# EAGLE schematic M8300B (EAGLE 6.6.0)

## Sheet 1 of 3
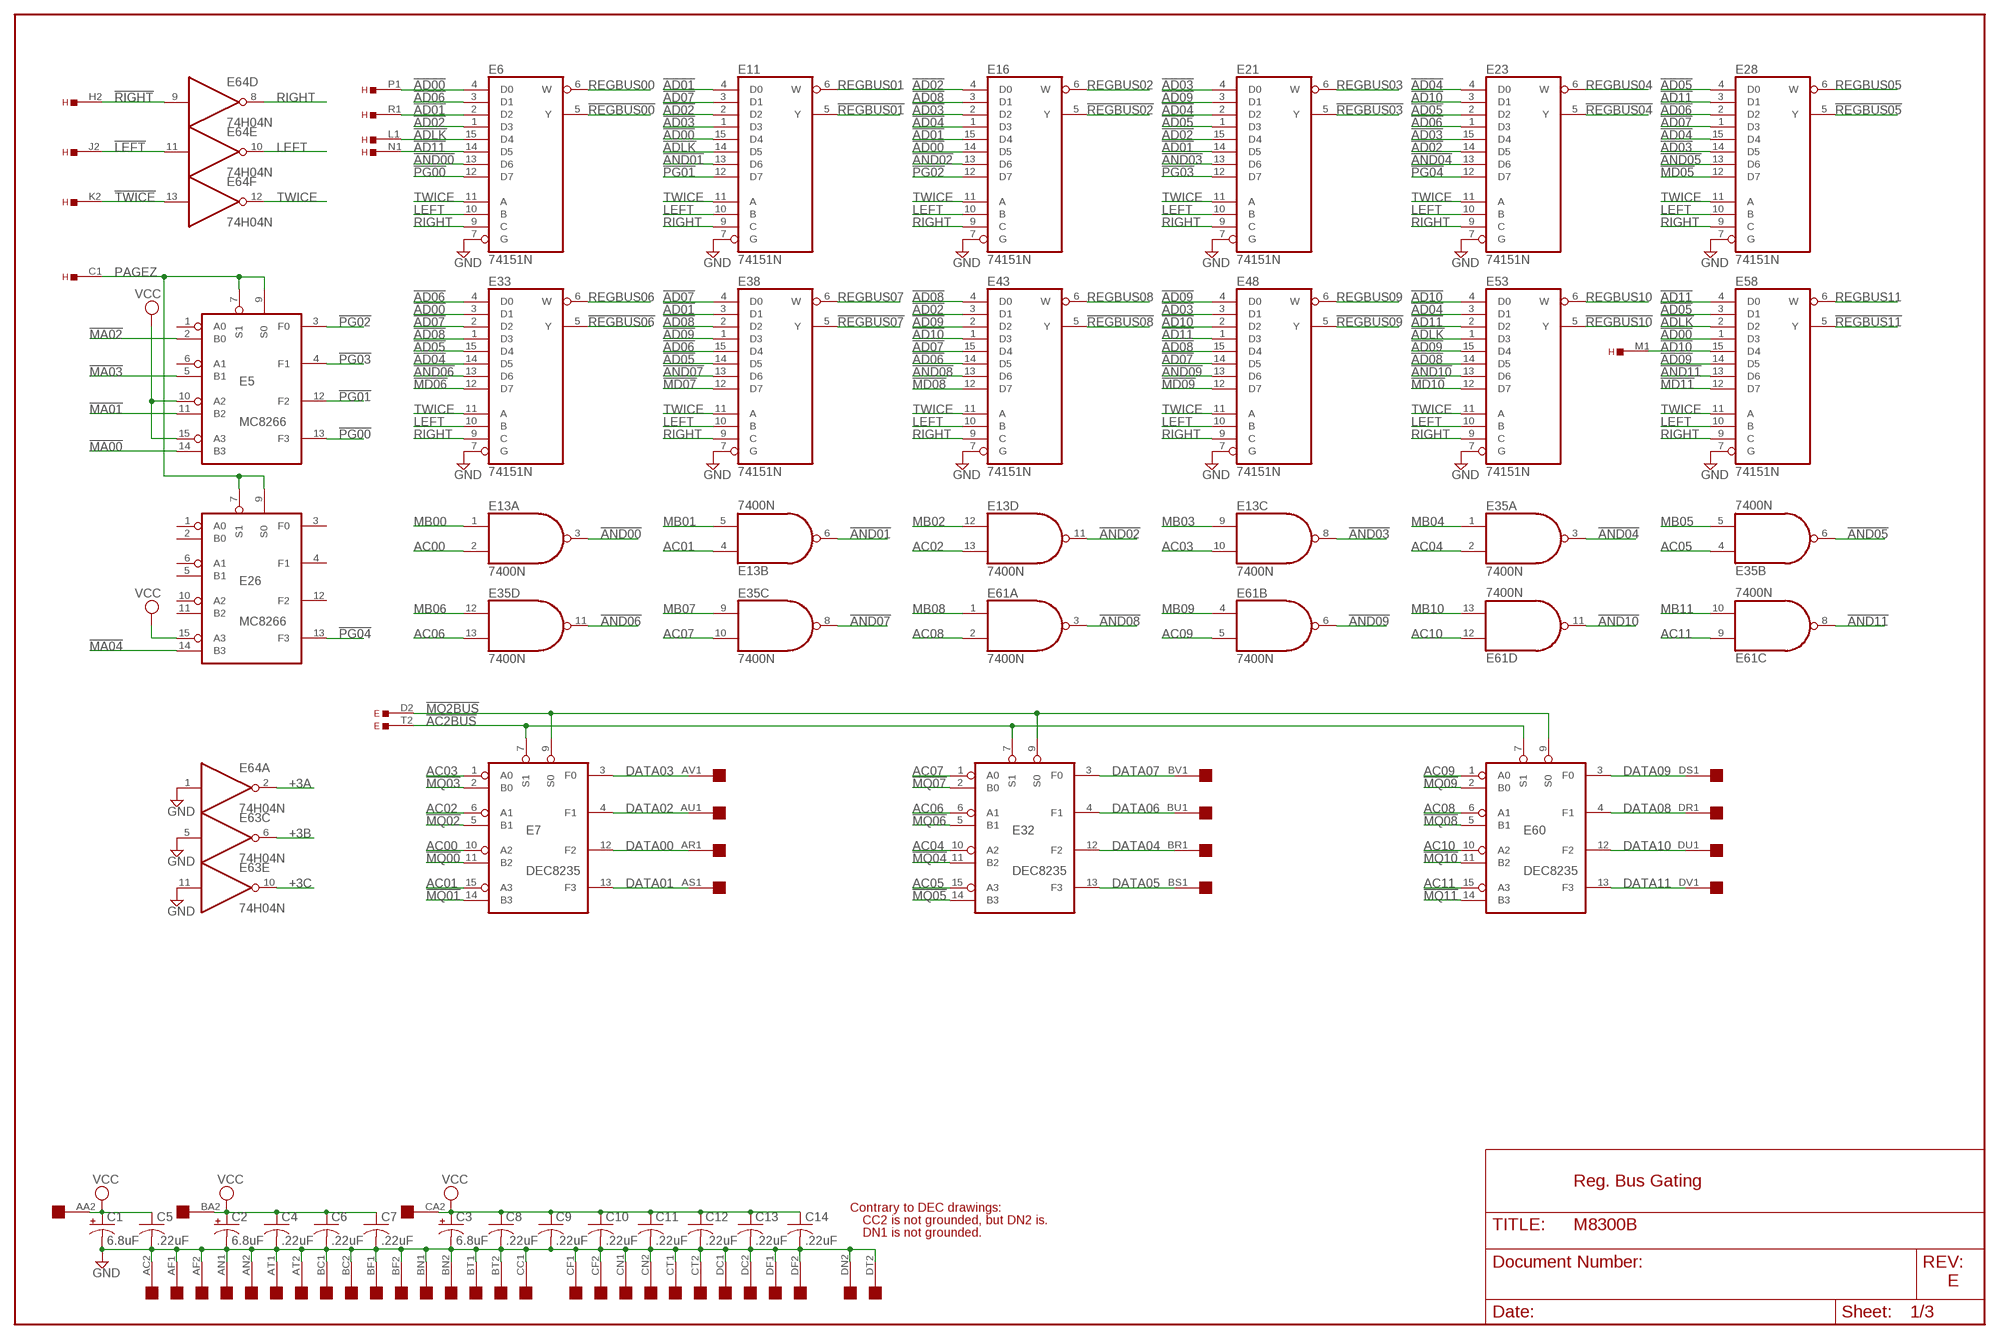
[diagram p0: schematic, sheet 1]

### Parts
C1  6.8uF  CPOL-USE20-8AXIAL  [E12-8]
C2  6.8uF  CPOL-USE20-8AXIAL  [E12-8]
C3  6.8uF  CPOL-USE20-8AXIAL  [E12-8]
C4  .22uF  C-US  [C063-025X075]
C5  .22uF  C-US  [C063-025X075]
C6  .22uF  C-US  [C063-025X075]
C7  .22uF  C-US  [C063-025X075]
C8  .22uF  C-US  [C063-025X075]
C9  .22uF  C-US  [C063-025X075]
C10  .22uF  C-US  [C063-025X075]
C11  .22uF  C-US  [C063-025X075]
C12  .22uF  C-US  [C063-025X075]
C13  .22uF  C-US  [C063-025X075]
C14  .22uF  C-US  [C063-025X075]
E  EDGE-TOP  [EDGE-CON2]
E5  MC8266  [DIL16]
E6  74151N  [DIL16]
E7  DEC8235  [DIL16]
E11  74151N  [DIL16]
E13  7400N  [DIL14]
E16  74151N  [DIL16]
E21  74151N  [DIL16]
E23  74151N  [DIL16]
E26  MC8266  [DIL16]
E28  74151N  [DIL16]
E32  DEC8235  [DIL16]
E33  74151N  [DIL16]
E35  7400N  [DIL14]
E38  74151N  [DIL16]
E43  74151N  [DIL16]
E48  74151N  [DIL16]
E53  74151N  [DIL16]
E58  74151N  [DIL16]
E60  DEC8235  [DIL16]
E61  7400N  [DIL14]
E63  74H04N  74S04N  [DIL14]
E64  74H04N  74S04N  [DIL14]
H  EDGE-TOP  [EDGE-CON2]
U$2  QUAD  [EDGE-CON8]

### Nets
!AC2BUS: E7.7(S1) E32.7(S1) E60.7(S1) E.T2
!AD00: E6.4(D0) E11.15(D4) E16.14(D5) E33.3(D1) E58.1(D3) H.P1 ; also sheet 2
!AD01: E6.2(D2) E11.4(D0) E16.15(D4) E21.14(D5) E38.3(D1) H.R1 ; also sheet 2
!AD02: E6.1(D3) E11.2(D2) E16.4(D0) E21.15(D4) E23.14(D5) E43.3(D1) ; also sheet 2
!AD03: E11.1(D3) E16.2(D2) E21.4(D0) E23.15(D4) E28.14(D5) E48.3(D1) ; also sheet 2
!AD04: E16.1(D3) E21.2(D2) E23.4(D0) E28.15(D4) E33.14(D5) E53.3(D1) ; also sheet 2
!AD05: E21.1(D3) E23.2(D2) E28.4(D0) E33.15(D4) E38.14(D5) E58.3(D1) ; also sheet 2
!AD06: E6.3(D1) E23.1(D3) E28.2(D2) E33.4(D0) E38.15(D4) E43.14(D5) ; also sheet 2
!AD07: E11.3(D1) E28.1(D3) E33.2(D2) E38.4(D0) E43.15(D4) E48.14(D5) ; also sheet 2
!AD08: E16.3(D1) E33.1(D3) E38.2(D2) E43.4(D0) E48.15(D4) E53.14(D5) ; also sheet 2
!AD09: E21.3(D1) E38.1(D3) E43.2(D2) E48.4(D0) E53.15(D4) E58.14(D5) ; also sheet 2
!AD10: E23.3(D1) E43.1(D3) E48.2(D2) E53.4(D0) E58.15(D4) H.M1 ; also sheet 2
!AD11: E6.14(D5) E28.3(D1) E48.1(D3) E53.2(D2) E58.4(D0) H.N1 ; also sheet 2
!ADLK: E6.15(D4) E11.14(D5) E53.1(D3) E58.2(D2) H.L1
!AND00: E6.13(D6) E13.3(A:O)
!AND01: E11.13(D6) E13.6(B:O)
!AND02: E13.11(D:O) E16.13(D6)
!AND03: E13.8(C:O) E21.13(D6)
!AND04: E23.13(D6) E35.3(A:O)
!AND05: E28.13(D6) E35.6(B:O)
!AND06: E33.13(D6) E35.11(D:O)
!AND07: E35.8(C:O) E38.13(D6)
!AND08: E43.13(D6) E61.3(A:O)
!AND09: E48.13(D6) E61.6(B:O)
!AND10: E53.13(D6) E61.11(D:O)
!AND11: E58.13(D6) E61.8(C:O)
!LEFT: E64.11(E:I) H.J2
!MA00: E5.14(B3) ; also sheet 2,3
!MA01: E5.11(B2) ; also sheet 2,3
!MA02: E5.2(B0) ; also sheet 2,3
!MA03: E5.5(B1) ; also sheet 2,3
!MA04: E26.14(B3) ; also sheet 2,3
!MD05: E28.12(D7) ; also sheet 2
!MD06: E33.12(D7) ; also sheet 2
!MD07: E38.12(D7) ; also sheet 2
!MD08: E43.12(D7) ; also sheet 2
!MD09: E48.12(D7) ; also sheet 2
!MD10: E53.12(D7) ; also sheet 2
!MD11: E58.12(D7) ; also sheet 2
!MQ00: E7.11(B2) ; also sheet 2,3
!MQ01: E7.14(B3) ; also sheet 2,3
!MQ02: E7.5(B1) ; also sheet 2,3
!MQ2BUS: E7.9(S0) E32.9(S0) E60.9(S0) E.D2
!MQ03: E7.2(B0) ; also sheet 2,3
!MQ04: E32.11(B2) ; also sheet 2,3
!MQ05: E32.14(B3) ; also sheet 2,3
!MQ06: E32.5(B1) ; also sheet 2,3
!MQ07: E32.2(B0) ; also sheet 2,3
!MQ08: E60.5(B1) ; also sheet 2,3
!MQ09: E60.2(B0) ; also sheet 2,3
!MQ10: E60.11(B2) ; also sheet 2,3
!MQ11: E60.14(B3) ; also sheet 2,3
!PG00: E5.13(F3) E6.12(D7)
!PG01: E5.12(F2) E11.12(D7)
!PG02: E5.3(F0) E16.12(D7)
!PG03: E5.4(F1) E21.12(D7)
!PG04: E23.12(D7) E26.13(F3)
!REGBUS00: E6.5(Y) ; also sheet 3
!REGBUS01: E11.5(Y) ; also sheet 3
!REGBUS02: E16.5(Y) ; also sheet 3
!REGBUS03: E21.5(Y) ; also sheet 3
!REGBUS04: E23.5(Y) ; also sheet 3
!REGBUS05: E28.5(Y) ; also sheet 3
!REGBUS06: E33.5(Y) ; also sheet 3
!REGBUS07: E38.5(Y) ; also sheet 3
!REGBUS08: E43.5(Y) ; also sheet 3
!REGBUS09: E48.5(Y) ; also sheet 3
!REGBUS10: E53.5(Y) ; also sheet 3
!REGBUS11: E58.5(Y) ; also sheet 3
!RIGHT: E64.9(D:I) H.H2 ; also sheet 2
!TWICE: E64.13(F:I) H.K2
+3A [supply]: E64.2(A:O) ; also sheet 3
+3B [supply]: E63.6(C:O) ; also sheet 2,3
+3C [supply]: E63.10(E:O) ; also sheet 2
AC00: E7.10(A2) E13.2(A:I1) ; also sheet 2,3
AC01: E7.15(A3) E13.4(B:I0) ; also sheet 2,3
AC02: E7.6(A1) E13.13(D:I1) ; also sheet 2,3
AC03: E7.1(A0) E13.10(C:I1) ; also sheet 2,3
AC04: E32.10(A2) E35.2(A:I1) ; also sheet 2,3
AC05: E32.15(A3) E35.4(B:I0) ; also sheet 2,3
AC06: E32.6(A1) E35.13(D:I1) ; also sheet 2,3
AC07: E32.1(A0) E35.10(C:I1) ; also sheet 2,3
AC08: E60.6(A1) E61.2(A:I1) ; also sheet 2,3
AC09: E60.1(A0) E61.5(B:I1) ; also sheet 2,3
AC10: E60.10(A2) E61.12(D:I0) ; also sheet 2,3
AC11: E60.15(A3) E61.9(C:I0) ; also sheet 2,3
DATA00: E7.12(F2) U$2.AR1 ; also sheet 2
DATA01: E7.13(F3) U$2.AS1 ; also sheet 2
DATA02: E7.4(F1) U$2.AU1 ; also sheet 2
DATA03: E7.3(F0) U$2.AV1 ; also sheet 2
DATA04: E32.12(F2) U$2.BR1 ; also sheet 2
DATA05: E32.13(F3) U$2.BS1 ; also sheet 2
DATA06: E32.4(F1) U$2.BU1 ; also sheet 2
DATA07: E32.3(F0) U$2.BV1 ; also sheet 2
DATA08: E60.4(F1) U$2.DR1 ; also sheet 2
DATA09: E60.3(F0) U$2.DS1 ; also sheet 2
DATA10: E60.12(F2) U$2.DU1 ; also sheet 2
DATA11: E60.13(F3) U$2.DV1 ; also sheet 2
GND [supply]: C1.- C2.- C3.- C4.2 C5.2 C6.2 C7.2 C8.2 C9.2 C10.2 C11.2 C12.2 C13.2 C14.2 E6.7(G) E11.7(G) E16.7(G) E21.7(G) E23.7(G) E28.7(G) E33.7(G) E38.7(G) E43.7(G) E48.7(G) E53.7(G) E58.7(G) E63.5(C:I) E63.11(E:I) E64.1(A:I) U$2.AC2 U$2.AF1 U$2.AF2 U$2.AN1 U$2.AN2 U$2.AT1 U$2.AT2 U$2.BC1 U$2.BC2 U$2.BF1 U$2.BF2 U$2.BN1 U$2.BN2 U$2.BT1 U$2.BT2 U$2.CC1 U$2.CF1 U$2.CF2 U$2.CN1 U$2.CN2 U$2.CT1 U$2.CT2 U$2.DC1 U$2.DC2 U$2.DF1 U$2.DF2 U$2.DN2 U$2.DT2 ; also sheet 2,3
LEFT: E6.10(B) E11.10(B) E16.10(B) E21.10(B) E23.10(B) E28.10(B) E33.10(B) E38.10(B) E43.10(B) E48.10(B) E53.10(B) E58.10(B) E64.10(E:O)
MB00: E13.1(A:I0) ; also sheet 2
MB01: E13.5(B:I1) ; also sheet 2
MB02: E13.12(D:I0) ; also sheet 2
MB03: E13.9(C:I0) ; also sheet 2
MB04: E35.1(A:I0) ; also sheet 2
MB05: E35.5(B:I1) ; also sheet 2
MB06: E35.12(D:I0) ; also sheet 2
MB07: E35.9(C:I0) ; also sheet 2
MB08: E61.1(A:I0) ; also sheet 2
MB09: E61.4(B:I0) ; also sheet 2
MB10: E61.13(D:I1) ; also sheet 2
MB11: E61.10(C:I1) ; also sheet 2
PAGEZ: E5.7(S1) E5.9(S0) E26.7(S1) E26.9(S0) H.C1
REGBUS00: E6.6(W) ; also sheet 2,3
REGBUS01: E11.6(W) ; also sheet 2,3
REGBUS02: E16.6(W) ; also sheet 2,3
REGBUS03: E21.6(W) ; also sheet 2,3
REGBUS04: E23.6(W) ; also sheet 2,3
REGBUS05: E28.6(W) ; also sheet 2,3
REGBUS06: E33.6(W) ; also sheet 2,3
REGBUS07: E38.6(W) ; also sheet 2,3
REGBUS08: E43.6(W) ; also sheet 2,3
REGBUS09: E48.6(W) ; also sheet 2,3
REGBUS10: E53.6(W) ; also sheet 2,3
REGBUS11: E58.6(W) ; also sheet 2,3
RIGHT: E6.9(C) E11.9(C) E16.9(C) E21.9(C) E23.9(C) E28.9(C) E33.9(C) E38.9(C) E43.9(C) E48.9(C) E53.9(C) E58.9(C) E64.8(D:O)
TWICE: E6.11(A) E11.11(A) E16.11(A) E21.11(A) E23.11(A) E28.11(A) E33.11(A) E38.11(A) E43.11(A) E48.11(A) E53.11(A) E58.11(A) E64.12(F:O)
VCC [supply]: C1.+ C2.+ C3.+ C4.1 C5.1 C6.1 C7.1 C8.1 C9.1 C10.1 C11.1 C12.1 C13.1 C14.1 E5.10(A2) E5.15(A3) E26.15(A3) U$2.AA2 U$2.BA2 U$2.CA2 ; also sheet 2
Unconnected: E5.1(A0) E5.6(A1) E26.1(A0) E26.2(B0) E26.3(F0) E26.4(F1) E26.5(B1) E26.6(A1) E26.10(A2) E26.11(B2) E26.12(F2) E64.3(B:I) E64.4(B:O) E.E1 E.F1 E.H1 E.H2 E.J1 E.J2 E.K1 E.K2 E.L2 E.M2 E.N2 E.P2 E.R2 E.S1 E.U1 E.U2 E.V1 E.V2 H.A2 H.B1 H.B2 H.C2 H.D2 H.E2 H.F2 H.L2 H.N2 H.P2 H.R2 H.S1 H.S2 H.T1 H.T2 H.U1 H.V1 U$2.AA1 U$2.AB1 U$2.AB2 U$2.AC1 U$2.AD2 U$2.AE2 U$2.AH2 U$2.AJ2 U$2.AL2 U$2.AM2 U$2.AP2 U$2.AR2 U$2.AS2 U$2.AU2 U$2.AV2 U$2.BA1 U$2.BB1 U$2.BB2 U$2.BD2 U$2.BE2 U$2.BH2 U$2.BJ2 U$2.BK2 U$2.BL2 U$2.BM2 U$2.BP2 U$2.BR2 U$2.BS2 U$2.BU2 U$2.BV2 U$2.CA1 U$2.CB1 U$2.CB2 U$2.CC2 U$2.CD1 U$2.CD2 U$2.CE1 U$2.CE2 U$2.CH1 U$2.CH2 U$2.CJ1 U$2.CJ2 U$2.CK1 U$2.CK2 U$2.CL1 U$2.CL2 U$2.CM1 U$2.CM2 U$2.CP1 U$2.CP2 U$2.CR2 U$2.CS1 U$2.CS2 U$2.CU1 U$2.CU2 U$2.CV1 U$2.CV2 U$2.DA1 U$2.DA2 U$2.DB1 U$2.DB2 U$2.DD2 U$2.DE2 U$2.DH2 U$2.DJ2 U$2.DK2 U$2.DL2 U$2.DM2 U$2.DN1 U$2.DP2 U$2.DR2 U$2.DS2 U$2.DT1 U$2.DU2 U$2.DV2

### Notes on the sheet
- Reg. Bus Gating
- Contrary to DEC drawings:
- CC2 is not grounded, but DN2 is.
- DN1 is not grounded.
- E

## Sheet 2 of 3
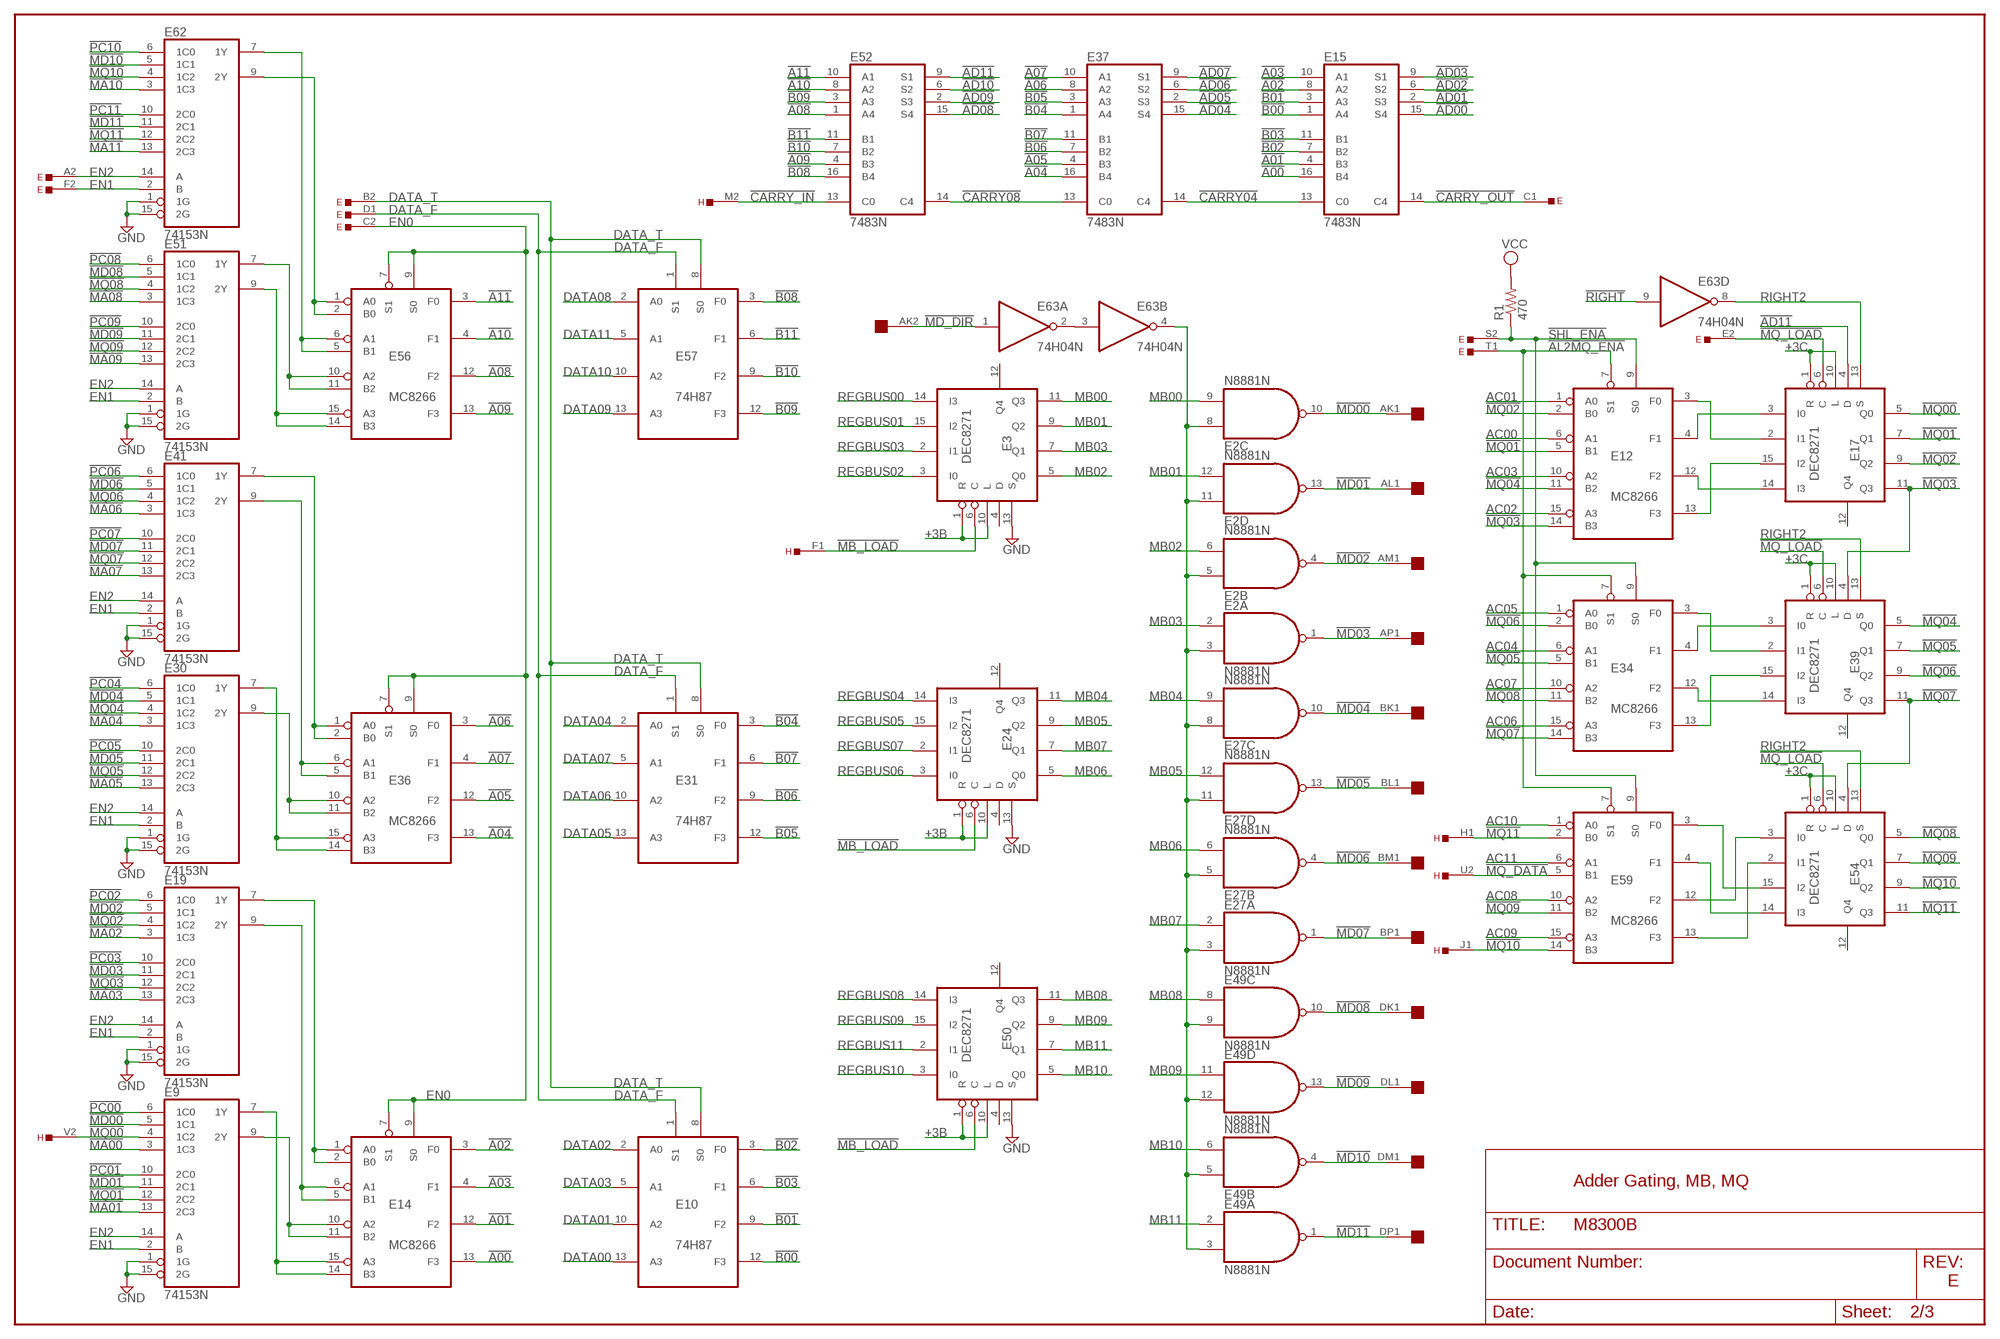
[diagram p1: schematic, sheet 2]

### Parts
E2  N8881N  [DIL14]
E3  DEC8271  [DIL16]
E9  74153N  74S153N  [DIL16]
E10  74H87  [DIL14]
E12  MC8266  [DIL16]
E14  MC8266  [DIL16]
E15  7483N  [DIL16]
E17  DEC8271  [DIL16]
E19  74153N  74S153N  [DIL16]
E24  DEC8271  [DIL16]
E27  N8881N  [DIL14]
E30  74153N  74S153N  [DIL16]
E31  74H87  [DIL14]
E34  MC8266  [DIL16]
E36  MC8266  [DIL16]
E37  7483N  [DIL16]
E39  DEC8271  [DIL16]
E41  74153N  74S153N  [DIL16]
E49  N8881N  [DIL14]
E50  DEC8271  [DIL16]
E51  74153N  74S153N  [DIL16]
E52  7483N  [DIL16]
E54  DEC8271  [DIL16]
E56  MC8266  [DIL16]
E57  74H87  [DIL14]
E59  MC8266  [DIL16]
E62  74153N  74S153N  [DIL16]
R1  470  R-US_0207/10  [0207/10]

### Nets
!A00: E14.13(F3) E15.16(B4)
!A01: E14.12(F2) E15.4(B3)
!A02: E14.3(F0) E15.8(A2)
!A03: E14.4(F1) E15.10(A1)
!A04: E36.13(F3) E37.16(B4)
!A05: E36.12(F2) E37.4(B3)
!A06: E36.3(F0) E37.8(A2)
!A07: E36.4(F1) E37.10(A1)
!A08: E52.1(A4) E56.12(F2)
!A09: E52.4(B3) E56.13(F3)
!A10: E52.8(A2) E56.4(F1)
!A11: E52.10(A1) E56.3(F0)
!AD00: E15.15(S4) ; also sheet 1
!AD01: E15.2(S3) ; also sheet 1
!AD02: E15.6(S2) ; also sheet 1
!AD03: E15.9(S1) ; also sheet 1
!AD04: E37.15(S4) ; also sheet 1
!AD05: E37.2(S3) ; also sheet 1
!AD06: E37.6(S2) ; also sheet 1
!AD07: E37.9(S1) ; also sheet 1
!AD08: E52.15(S4) ; also sheet 1
!AD09: E52.2(S3) ; also sheet 1
!AD10: E52.6(S2) ; also sheet 1
!AD11: E17.4(D) E52.9(S1) ; also sheet 1
!AL2MQ_ENA: E12.7(S1) E34.7(S1) E59.7(S1) E.T1
!B00: E10.12(F3) E15.1(A4)
!B01: E10.9(F2) E15.3(A3)
!B02: E10.3(F0) E15.7(B2)
!B03: E10.6(F1) E15.11(B1)
!B04: E31.3(F0) E37.1(A4)
!B05: E31.12(F3) E37.3(A3)
!B06: E31.9(F2) E37.7(B2)
!B07: E31.6(F1) E37.11(B1)
!B08: E52.16(B4) E57.3(F0)
!B09: E52.3(A3) E57.12(F3)
!B10: E52.7(B2) E57.9(F2)
!B11: E52.11(B1) E57.6(F1)
!CARRY04: E15.13(C0) E37.14(C4)
!CARRY08: E37.13(C0) E52.14(C4)
!CARRY_IN: E52.13(C0) H.M2
!CARRY_OUT: E15.14(C4) E.C1
!MA00: E9.3(1C3) ; also sheet 1,3
!MA01: E9.13(2C3) ; also sheet 1,3
!MA02: E19.3(1C3) ; also sheet 1,3
!MA03: E19.13(2C3) ; also sheet 1,3
!MA04: E30.3(1C3) ; also sheet 1,3
!MA05: E30.13(2C3) ; also sheet 3
!MA06: E41.3(1C3) ; also sheet 3
!MA07: E41.13(2C3) ; also sheet 3
!MA08: E51.3(1C3) ; also sheet 3
!MA09: E51.13(2C3) ; also sheet 3
!MA10: E62.3(1C3) ; also sheet 3
!MA11: E62.13(2C3) ; also sheet 3
!MB_LOAD: E3.6(C) E24.6(C) E50.6(C) H.F1
!MD00: E2.10(C:O) E9.5(1C1) U$2.AK1
!MD01: E2.13(D:O) E9.11(2C1) U$2.AL1
!MD02: E2.4(B:O) E19.5(1C1) U$2.AM1
!MD03: E2.1(A:O) E19.11(2C1) U$2.AP1
!MD04: E27.10(C:O) E30.5(1C1) U$2.BK1
!MD05: E27.13(D:O) E30.11(2C1) U$2.BL1 ; also sheet 1
!MD06: E27.4(B:O) E41.5(1C1) U$2.BM1 ; also sheet 1
!MD07: E27.1(A:O) E41.11(2C1) U$2.BP1 ; also sheet 1
!MD08: E49.10(C:O) E51.5(1C1) U$2.DK1 ; also sheet 1
!MD09: E49.13(D:O) E51.11(2C1) U$2.DL1 ; also sheet 1
!MD10: E49.4(B:O) E62.5(1C1) U$2.DM1 ; also sheet 1
!MD11: E49.1(A:O) E62.11(2C1) U$2.DP1 ; also sheet 1
!MD_DIR: E63.1(A:I) U$2.AK2
!MQ00: E9.4(1C2) E17.5(Q0) H.V2 ; also sheet 1,3
!MQ01: E9.12(2C2) E12.5(B1) E17.7(Q1) ; also sheet 1,3
!MQ02: E12.2(B0) E17.9(Q2) E19.4(1C2) ; also sheet 1,3
!MQ03: E12.14(B3) E17.11(Q3) E19.12(2C2) E39.4(D) ; also sheet 1,3
!MQ04: E12.11(B2) E30.4(1C2) E39.5(Q0) ; also sheet 1,3
!MQ05: E30.12(2C2) E34.5(B1) E39.7(Q1) ; also sheet 1,3
!MQ06: E34.2(B0) E39.9(Q2) E41.4(1C2) ; also sheet 1,3
!MQ07: E34.14(B3) E39.11(Q3) E41.12(2C2) E54.4(D) ; also sheet 1,3
!MQ08: E34.11(B2) E51.4(1C2) E54.5(Q0) ; also sheet 1,3
!MQ09: E51.12(2C2) E54.7(Q1) E59.11(B2) ; also sheet 1,3
!MQ10: E54.9(Q2) E59.14(B3) E62.4(1C2) H.J1 ; also sheet 1,3
!MQ11: E54.11(Q3) E59.2(B0) E62.12(2C2) H.H1 ; also sheet 1,3
!MQ_DATA: E59.5(B1) H.U2
!MQ_LOAD: E17.6(C) E39.6(C) E54.6(C) E.E2
!PC00: E9.6(1C0) ; also sheet 3
!PC01: E9.10(2C0) ; also sheet 3
!PC02: E19.6(1C0) ; also sheet 3
!PC03: E19.10(2C0) ; also sheet 3
!PC04: E30.6(1C0) ; also sheet 3
!PC05: E30.10(2C0) ; also sheet 3
!PC06: E41.6(1C0) ; also sheet 3
!PC07: E41.10(2C0) ; also sheet 3
!PC08: E51.6(1C0) ; also sheet 3
!PC09: E51.10(2C0) ; also sheet 3
!PC10: E62.6(1C0) ; also sheet 3
!PC11: E62.10(2C0) ; also sheet 3
!RIGHT: E63.9(D:I) ; also sheet 1
!SHL_ENA: E12.9(S0) E34.9(S0) E59.9(S0) E.S2 R1.1
+3B [supply]: E3.1(R) E3.10(L) E24.1(R) E24.10(L) E50.1(R) E50.10(L) ; also sheet 1,3
+3C [supply]: E17.1(R) E17.10(L) E39.1(R) E39.10(L) E54.1(R) E54.10(L) ; also sheet 1
AC00: E12.6(A1) ; also sheet 1,3
AC01: E12.1(A0) ; also sheet 1,3
AC02: E12.15(A3) ; also sheet 1,3
AC03: E12.10(A2) ; also sheet 1,3
AC04: E34.6(A1) ; also sheet 1,3
AC05: E34.1(A0) ; also sheet 1,3
AC06: E34.15(A3) ; also sheet 1,3
AC07: E34.10(A2) ; also sheet 1,3
AC08: E59.10(A2) ; also sheet 1,3
AC09: E59.15(A3) ; also sheet 1,3
AC10: E59.1(A0) ; also sheet 1,3
AC11: E59.6(A1) ; also sheet 1,3
DATA00: E10.13(A3) ; also sheet 1
DATA01: E10.10(A2) ; also sheet 1
DATA02: E10.2(A0) ; also sheet 1
DATA03: E10.5(A1) ; also sheet 1
DATA04: E31.2(A0) ; also sheet 1
DATA05: E31.13(A3) ; also sheet 1
DATA06: E31.10(A2) ; also sheet 1
DATA07: E31.5(A1) ; also sheet 1
DATA08: E57.2(A0) ; also sheet 1
DATA09: E57.13(A3) ; also sheet 1
DATA10: E57.10(A2) ; also sheet 1
DATA11: E57.5(A1) ; also sheet 1
DATA_F: E10.1(S1) E31.1(S1) E57.1(S1) E.D1
DATA_T: E10.8(S0) E31.8(S0) E57.8(S0) E.B2
EN0: E14.7(S1) E14.9(S0) E36.7(S1) E36.9(S0) E56.7(S1) E56.9(S0) E.C2
EN1: E9.2(B) E19.2(B) E30.2(B) E41.2(B) E51.2(B) E62.2(B) E.F2
EN2: E9.14(A) E19.14(A) E30.14(A) E41.14(A) E51.14(A) E62.14(A) E.A2
GND [supply]: E3.13(S) E9.1(1G) E9.15(2G) E19.1(1G) E19.15(2G) E24.13(S) E30.1(1G) E30.15(2G) E41.1(1G) E41.15(2G) E50.13(S) E51.1(1G) E51.15(2G) E62.1(1G) E62.15(2G) ; also sheet 1,3
MB00: E2.9(C:I1) E3.11(Q3) ; also sheet 1
MB01: E2.12(D:I1) E3.9(Q2) ; also sheet 1
MB02: E2.6(B:I1) E3.5(Q0) ; also sheet 1
MB03: E2.2(A:I0) E3.7(Q1) ; also sheet 1
MB04: E24.11(Q3) E27.9(C:I1) ; also sheet 1
MB05: E24.9(Q2) E27.12(D:I1) ; also sheet 1
MB06: E24.5(Q0) E27.6(B:I1) ; also sheet 1
MB07: E24.7(Q1) E27.2(A:I0) ; also sheet 1
MB08: E49.8(C:I0) E50.11(Q3) ; also sheet 1
MB09: E49.11(D:I0) E50.9(Q2) ; also sheet 1
MB10: E49.6(B:I1) E50.5(Q0) ; also sheet 1
MB11: E49.2(A:I0) E50.7(Q1) ; also sheet 1
N$2: E12.3(F0) E17.2(I1)
N$3: E34.12(F2) E39.14(I3)
N$4: E34.4(F1) E39.3(I0)
N$5: E63.2(A:O) E63.3(B:I)
N$6: E12.4(F1) E17.3(I0)
N$7: E54.15(I2) E59.3(F0)
N$8: E9.9(2Y) E14.10(A2) E14.11(B2)
N$9: E9.7(1Y) E14.14(B3) E14.15(A3)
N$10: E51.7(1Y) E56.10(A2) E56.11(B2)
N$11: E34.3(F0) E39.2(I1)
N$12: E2.3(A:I1) E2.5(B:I0) E2.8(C:I0) E2.11(D:I0) E27.3(A:I1) E27.5(B:I0) E27.8(C:I0) E27.11(D:I0) E49.3(A:I1) E49.5(B:I0) E49.9(C:I1) E49.12(D:I1) E63.4(B:O)
N$13: E14.5(B1) E14.6(A1) E19.9(2Y)
N$18: E34.13(F3) E39.15(I2)
N$19: E54.2(I1) E59.13(F3)
N$20: E54.14(I3) E59.4(F1)
N$21: E14.1(A0) E14.2(B0) E19.7(1Y)
N$22: E54.3(I0) E59.12(F2)
N$23: E12.12(F2) E17.14(I3)
N$24: E12.13(F3) E17.15(I2)
N$36: E30.7(1Y) E36.14(B3) E36.15(A3)
N$37: E30.9(2Y) E36.10(A2) E36.11(B2)
N$38: E36.5(B1) E36.6(A1) E41.9(2Y)
N$39: E36.1(A0) E36.2(B0) E41.7(1Y)
N$40: E51.9(2Y) E56.14(B3) E56.15(A3)
N$42: E56.5(B1) E56.6(A1) E62.7(1Y)
N$43: E56.1(A0) E56.2(B0) E62.9(2Y)
REGBUS00: E3.14(I3) ; also sheet 1,3
REGBUS01: E3.15(I2) ; also sheet 1,3
REGBUS02: E3.3(I0) ; also sheet 1,3
REGBUS03: E3.2(I1) ; also sheet 1,3
REGBUS04: E24.14(I3) ; also sheet 1,3
REGBUS05: E24.15(I2) ; also sheet 1,3
REGBUS06: E24.3(I0) ; also sheet 1,3
REGBUS07: E24.2(I1) ; also sheet 1,3
REGBUS08: E50.14(I3) ; also sheet 1,3
REGBUS09: E50.15(I2) ; also sheet 1,3
REGBUS10: E50.3(I0) ; also sheet 1,3
REGBUS11: E50.2(I1) ; also sheet 1,3
RIGHT2: E17.13(S) E39.13(S) E54.13(S) E63.8(D:O)
VCC [supply]: R1.2 ; also sheet 1
Unconnected: E3.4(D) E3.12(Q4) E17.12(Q4) E24.4(D) E24.12(Q4) E39.12(Q4) E50.4(D) E50.12(Q4) E54.12(Q4)

### Notes on the sheet
- Adder Gating, MB, MQ
- E

## Sheet 3 of 3
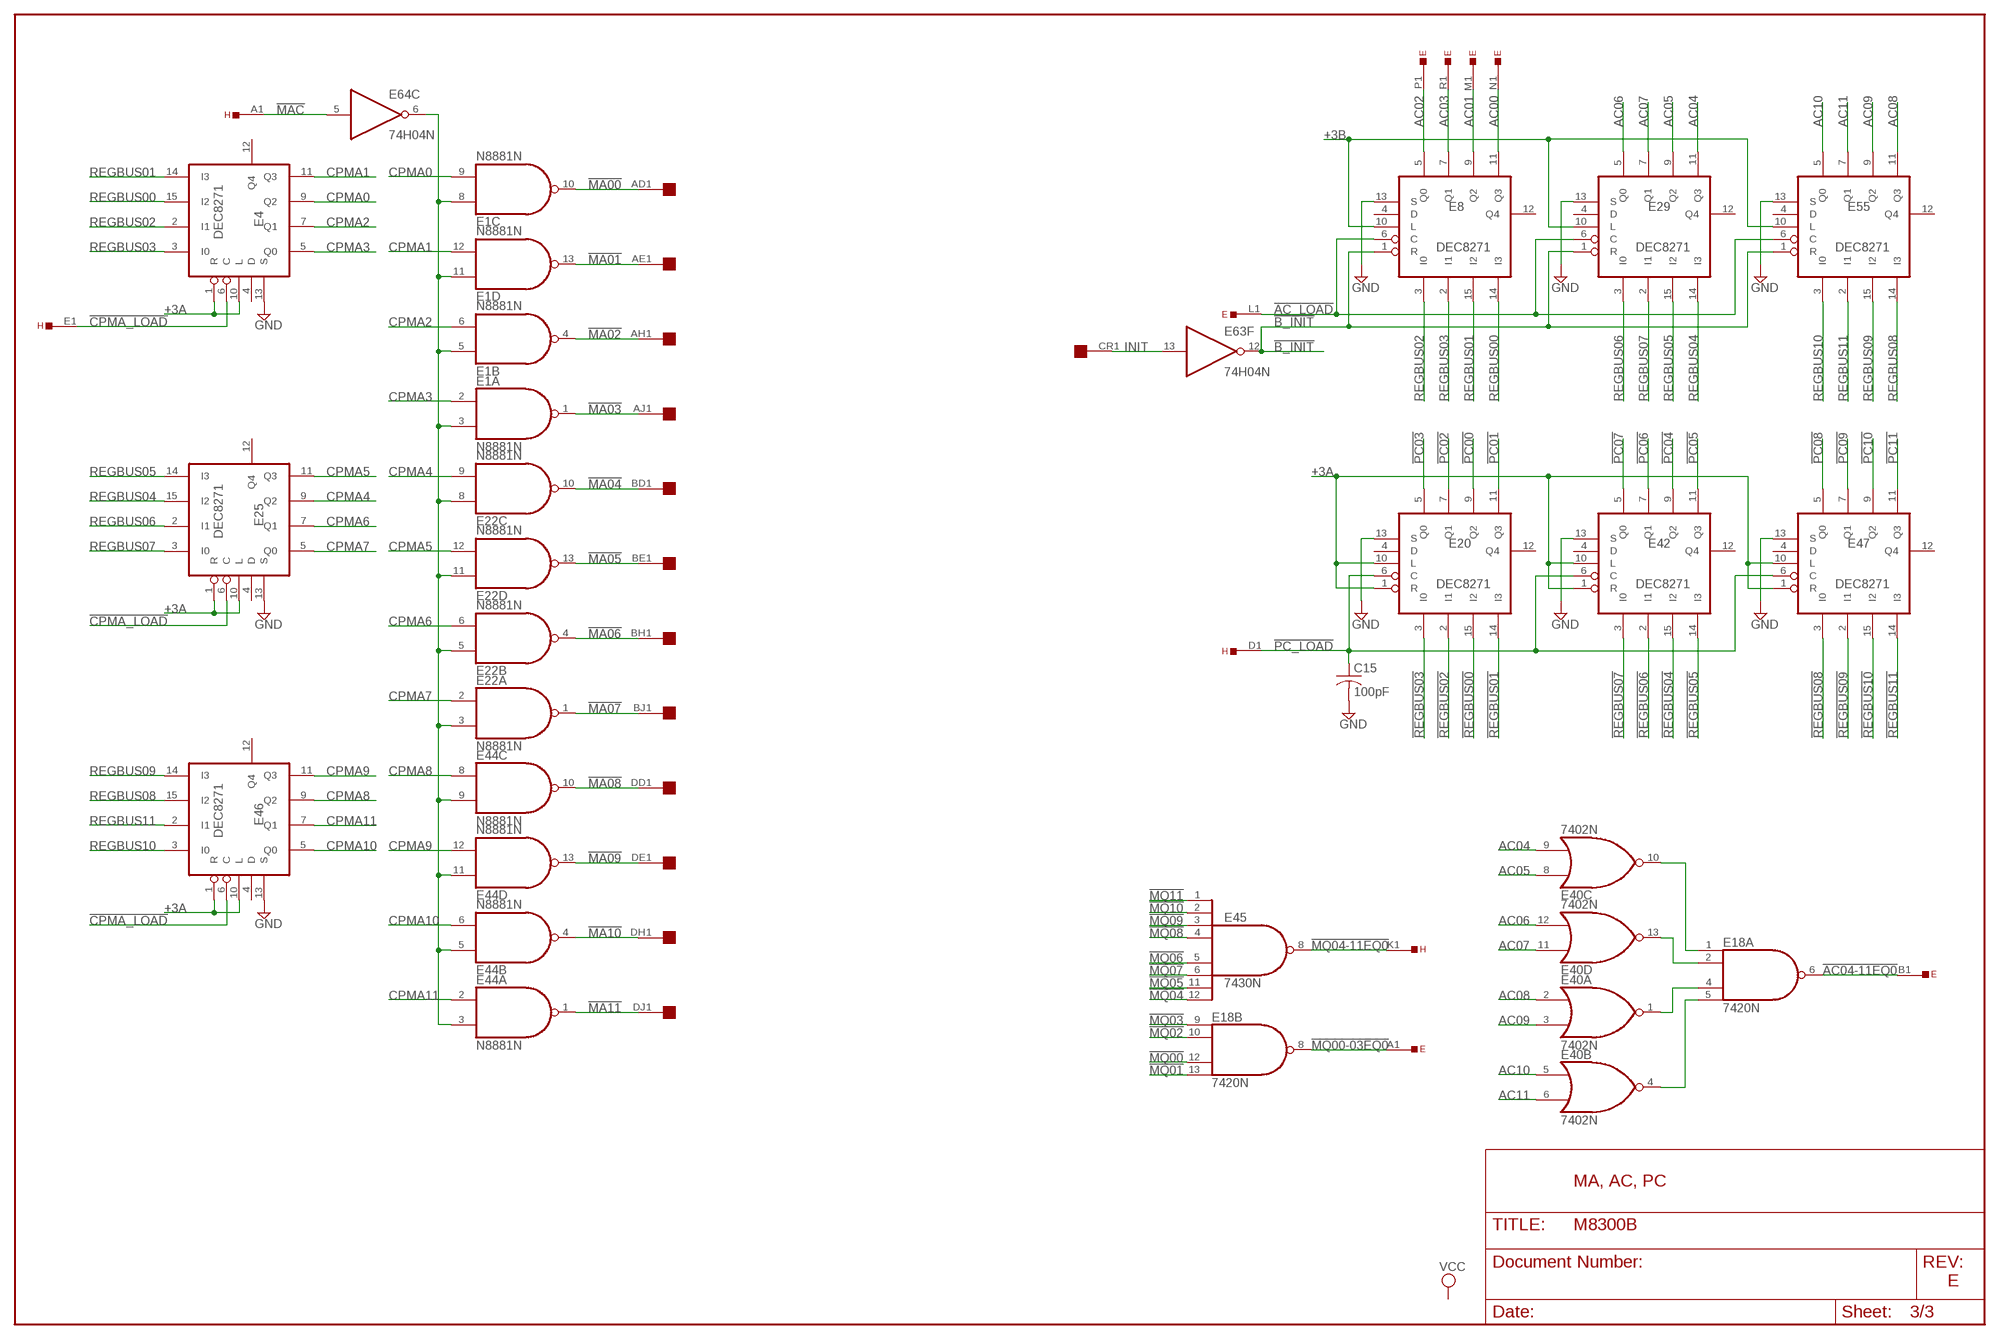
[diagram p2: schematic, sheet 3]

### Parts
C15  100pF  C-US  [C063-025X075]
E1  N8881N  [DIL14]
E4  DEC8271  [DIL16]
E8  DEC8271  [DIL16]
E18  7420N  74S20N  [DIL14]
E20  DEC8271  [DIL16]
E22  N8881N  [DIL14]
E25  DEC8271  [DIL16]
E29  DEC8271  [DIL16]
E40  7402N  [DIL14]
E42  DEC8271  [DIL16]
E44  N8881N  [DIL14]
E45  7430N  [DIL14]
E46  DEC8271  [DIL16]
E47  DEC8271  [DIL16]
E55  DEC8271  [DIL16]

### Nets
!AC04-11EQ0: E18.6(A:O) E.B1
!AC_LOAD: E8.6(C) E29.6(C) E55.6(C) E.L1
!B_INIT: E8.1(R) E29.1(R) E55.1(R) E63.12(F:O)
!CPMA_LOAD: E4.6(C) E25.6(C) E46.6(C) H.E1
!MA00: E1.10(C:O) U$2.AD1 ; also sheet 1,2
!MA01: E1.13(D:O) U$2.AE1 ; also sheet 1,2
!MA02: E1.4(B:O) U$2.AH1 ; also sheet 1,2
!MA03: E1.1(A:O) U$2.AJ1 ; also sheet 1,2
!MA04: E22.10(C:O) U$2.BD1 ; also sheet 1,2
!MA05: E22.13(D:O) U$2.BE1 ; also sheet 2
!MA06: E22.4(B:O) U$2.BH1 ; also sheet 2
!MA07: E22.1(A:O) U$2.BJ1 ; also sheet 2
!MA08: E44.10(C:O) U$2.DD1 ; also sheet 2
!MA09: E44.13(D:O) U$2.DE1 ; also sheet 2
!MA10: E44.4(B:O) U$2.DH1 ; also sheet 2
!MA11: E44.1(A:O) U$2.DJ1 ; also sheet 2
!MAC: E64.5(C:I) H.A1
!MQ00: E18.12(B:I2) ; also sheet 1,2
!MQ00-03EQ0: E18.8(B:O) E.A1
!MQ01: E18.13(B:I3) ; also sheet 1,2
!MQ02: E18.10(B:I1) ; also sheet 1,2
!MQ03: E18.9(B:I0) ; also sheet 1,2
!MQ04: E45.12(I7) ; also sheet 1,2
!MQ04-11EQ0: E45.8(O) H.K1
!MQ05: E45.11(I6) ; also sheet 1,2
!MQ06: E45.5(I4) ; also sheet 1,2
!MQ07: E45.6(I5) ; also sheet 1,2
!MQ08: E45.4(I3) ; also sheet 1,2
!MQ09: E45.3(I2) ; also sheet 1,2
!MQ10: E45.2(I1) ; also sheet 1,2
!MQ11: E45.1(I0) ; also sheet 1,2
!PC00: E20.9(Q2) ; also sheet 2
!PC01: E20.11(Q3) ; also sheet 2
!PC02: E20.7(Q1) ; also sheet 2
!PC03: E20.5(Q0) ; also sheet 2
!PC04: E42.9(Q2) ; also sheet 2
!PC05: E42.11(Q3) ; also sheet 2
!PC06: E42.7(Q1) ; also sheet 2
!PC07: E42.5(Q0) ; also sheet 2
!PC08: E47.5(Q0) ; also sheet 2
!PC09: E47.7(Q1) ; also sheet 2
!PC10: E47.9(Q2) ; also sheet 2
!PC11: E47.11(Q3) ; also sheet 2
!PC_LOAD: C15.1 E20.6(C) E42.6(C) E47.6(C) H.D1
!REGBUS00: E20.15(I2) ; also sheet 1
!REGBUS01: E20.14(I3) ; also sheet 1
!REGBUS02: E20.2(I1) ; also sheet 1
!REGBUS03: E20.3(I0) ; also sheet 1
!REGBUS04: E42.15(I2) ; also sheet 1
!REGBUS05: E42.14(I3) ; also sheet 1
!REGBUS06: E42.2(I1) ; also sheet 1
!REGBUS07: E42.3(I0) ; also sheet 1
!REGBUS08: E47.3(I0) ; also sheet 1
!REGBUS09: E47.2(I1) ; also sheet 1
!REGBUS10: E47.15(I2) ; also sheet 1
!REGBUS11: E47.14(I3) ; also sheet 1
+3A [supply]: E4.1(R) E4.10(L) E20.1(R) E20.10(L) E25.1(R) E25.10(L) E42.1(R) E42.10(L) E46.1(R) E46.10(L) E47.1(R) E47.10(L) ; also sheet 1
+3B [supply]: E8.10(L) E29.10(L) E55.10(L) ; also sheet 1,2
AC00: E8.11(Q3) E.N1 ; also sheet 1,2
AC01: E8.9(Q2) E.M1 ; also sheet 1,2
AC02: E8.5(Q0) E.P1 ; also sheet 1,2
AC03: E8.7(Q1) E.R1 ; also sheet 1,2
AC04: E29.11(Q3) E40.9(C:I1) ; also sheet 1,2
AC05: E29.9(Q2) E40.8(C:I0) ; also sheet 1,2
AC06: E29.5(Q0) E40.12(D:I1) ; also sheet 1,2
AC07: E29.7(Q1) E40.11(D:I0) ; also sheet 1,2
AC08: E40.2(A:I0) E55.11(Q3) ; also sheet 1,2
AC09: E40.3(A:I1) E55.9(Q2) ; also sheet 1,2
AC10: E40.5(B:I0) E55.5(Q0) ; also sheet 1,2
AC11: E40.6(B:I1) E55.7(Q1) ; also sheet 1,2
CPMA0: E1.9(C:I1) E4.9(Q2)
CPMA1: E1.12(D:I1) E4.11(Q3)
CPMA2: E1.6(B:I1) E4.7(Q1)
CPMA3: E1.2(A:I0) E4.5(Q0)
CPMA4: E22.9(C:I1) E25.9(Q2)
CPMA5: E22.12(D:I1) E25.11(Q3)
CPMA6: E22.6(B:I1) E25.7(Q1)
CPMA7: E22.2(A:I0) E25.5(Q0)
CPMA8: E44.8(C:I0) E46.9(Q2)
CPMA9: E44.12(D:I1) E46.11(Q3)
CPMA10: E44.6(B:I1) E46.5(Q0)
CPMA11: E44.2(A:I0) E46.7(Q1)
GND [supply]: C15.2 E4.13(S) E8.13(S) E20.13(S) E25.13(S) E29.13(S) E42.13(S) E46.13(S) E47.13(S) E55.13(S) ; also sheet 1,2
INIT: E63.13(F:I) U$2.CR1
N$1: E1.3(A:I1) E1.5(B:I0) E1.8(C:I0) E1.11(D:I0) E22.3(A:I1) E22.5(B:I0) E22.8(C:I0) E22.11(D:I0) E44.3(A:I1) E44.5(B:I0) E44.9(C:I1) E44.11(D:I0) E64.6(C:O)
N$28: E18.4(A:I2) E40.1(A:O)
N$29: E18.2(A:I1) E40.13(D:O)
N$30: E18.5(A:I3) E40.4(B:O)
N$31: E18.1(A:I0) E40.10(C:O)
REGBUS00: E4.15(I2) E8.14(I3) ; also sheet 1,2
REGBUS01: E4.14(I3) E8.15(I2) ; also sheet 1,2
REGBUS02: E4.2(I1) E8.3(I0) ; also sheet 1,2
REGBUS03: E4.3(I0) E8.2(I1) ; also sheet 1,2
REGBUS04: E25.15(I2) E29.14(I3) ; also sheet 1,2
REGBUS05: E25.14(I3) E29.15(I2) ; also sheet 1,2
REGBUS06: E25.2(I1) E29.3(I0) ; also sheet 1,2
REGBUS07: E25.3(I0) E29.2(I1) ; also sheet 1,2
REGBUS08: E46.15(I2) E55.14(I3) ; also sheet 1,2
REGBUS09: E46.14(I3) E55.15(I2) ; also sheet 1,2
REGBUS10: E46.3(I0) E55.3(I0) ; also sheet 1,2
REGBUS11: E46.2(I1) E55.2(I1) ; also sheet 1,2
Unconnected: E4.4(D) E4.12(Q4) E8.4(D) E8.12(Q4) E20.4(D) E20.12(Q4) E25.4(D) E25.12(Q4) E29.4(D) E29.12(Q4) E42.4(D) E42.12(Q4) E46.4(D) E46.12(Q4) E47.4(D) E47.12(Q4) E55.4(D) E55.12(Q4)

### Notes on the sheet
- MA, AC, PC
- E

## Power pins joined to a net without a drawn wire
GND: E1.7(P:GND) E2.7(P:GND) E3.8(GND) E4.8(GND) E5.8(GND) E6.8(GND) E7.8(GND) E8.8(GND) E9.8(GND) E10.7(GND) E11.8(GND) E12.8(GND) E13.7(P:GND) E14.8(GND) E15.12(GND) E16.8(GND) E17.8(GND) E18.7(P:GND) E19.8(GND) E20.8(GND) E21.8(GND) E22.7(P:GND) E23.8(GND) E24.8(GND) E25.8(GND) E26.8(GND) E27.7(P:GND) E28.8(GND) E29.8(GND) E30.8(GND) E31.7(GND) E32.8(GND) E33.8(GND) E34.8(GND) E35.7(P:GND) E36.8(GND) E37.12(GND) E38.8(GND) E39.8(GND) E40.7(P:GND) E41.8(GND) E42.8(GND) E43.8(GND) E44.7(P:GND) E45.7(GND) E46.8(GND) E47.8(GND) E48.8(GND) E49.7(P:GND) E50.8(GND) E51.8(GND) E52.12(GND) E53.8(GND) E54.8(GND) E55.8(GND) E56.8(GND) E57.7(GND) E58.8(GND) E59.8(GND) E60.8(GND) E61.7(P:GND) E62.8(GND) E63.7(P:GND) E64.7(P:GND)
VCC: E1.14(P:VCC) E2.14(P:VCC) E3.16(VCC) E4.16(VCC) E5.16(VCC) E6.16(VCC) E7.16(VCC) E8.16(VCC) E9.16(VCC) E10.14(VCC) E11.16(VCC) E12.16(VCC) E13.14(P:VCC) E14.16(VCC) E15.5(VCC) E16.16(VCC) E17.16(VCC) E18.14(P:VCC) E19.16(VCC) E20.16(VCC) E21.16(VCC) E22.14(P:VCC) E23.16(VCC) E24.16(VCC) E25.16(VCC) E26.16(VCC) E27.14(P:VCC) E28.16(VCC) E29.16(VCC) E30.16(VCC) E31.14(VCC) E32.16(VCC) E33.16(VCC) E34.16(VCC) E35.14(P:VCC) E36.16(VCC) E37.5(VCC) E38.16(VCC) E39.16(VCC) E40.14(P:VCC) E41.16(VCC) E42.16(VCC) E43.16(VCC) E44.14(P:VCC) E45.14(VCC) E46.16(VCC) E47.16(VCC) E48.16(VCC) E49.14(P:VCC) E50.16(VCC) E51.16(VCC) E52.5(VCC) E53.16(VCC) E54.16(VCC) E55.16(VCC) E56.16(VCC) E57.14(VCC) E58.16(VCC) E59.16(VCC) E60.16(VCC) E61.14(P:VCC) E62.16(VCC) E63.14(P:VCC) E64.14(P:VCC)

## Library data of the parts
C1-C3 = dec-con:CPOL-USE20-8AXIAL: A 0.8 inch electrolytic.
C4-C15 = dec-con:C-US: Capacitors with funky DEC lead spacing.
E H = dec-con:EDGE-TOP: Labeled DEC edge connector, suitable for top connector.
E1 E2 E22 E27 E44 E49 = dec-con:N8881: Quad 2-input NAND gate, open collector
E3 E4 E8 E17 E20 E24 E25 E29 E39 E42 E46 E47 E50 E54 E55 = dec-con:DEC8271: Parallel Load Shift Register
E5 E12 E14 E26 E34 E36 E56 E59 = dec-con:MC8266: Quad 2-1 selector
E6 E11 E16 E21 E23 E28 E33 E38 E43 E48 E53 E58 = 74xx-us:74*151: Data SELECTOR/MULTIPLEXER
E7 E32 E60 = dec-con:DEC8235: 4-bit data selector
E9 E19 E30 E41 E51 E62 = 74xx-us:74*153: Dual 4-line to 1-line data SELECTOR/MULTIPLEXER
E10 E31 E57 = dec-con:74*87: Complement, true, 1, or 0 gate
E13 E35 E61 = 74xx-us:74*00: Quad 2-input NAND gate
E15 E37 E52 = 74xx-us:74*83: 4-bit binary full ADDER, fast carry
E18 = 74xx-us:74*20: Dual 4-input NAND gate
E40 = 74xx-us:74*02: Quad 2-input NOR gate
E45 = 74xx-us:74*30: 8-input NAND gate
E63 E64 = 74xx-us:74*04: Hex INVERTER
R1 = rcl:R-US_: RESISTOR, American symbol
U$2 = dec-con:QUAD: Quad-Height DEC board

## Net classes
1 supply: width 0.813 mm